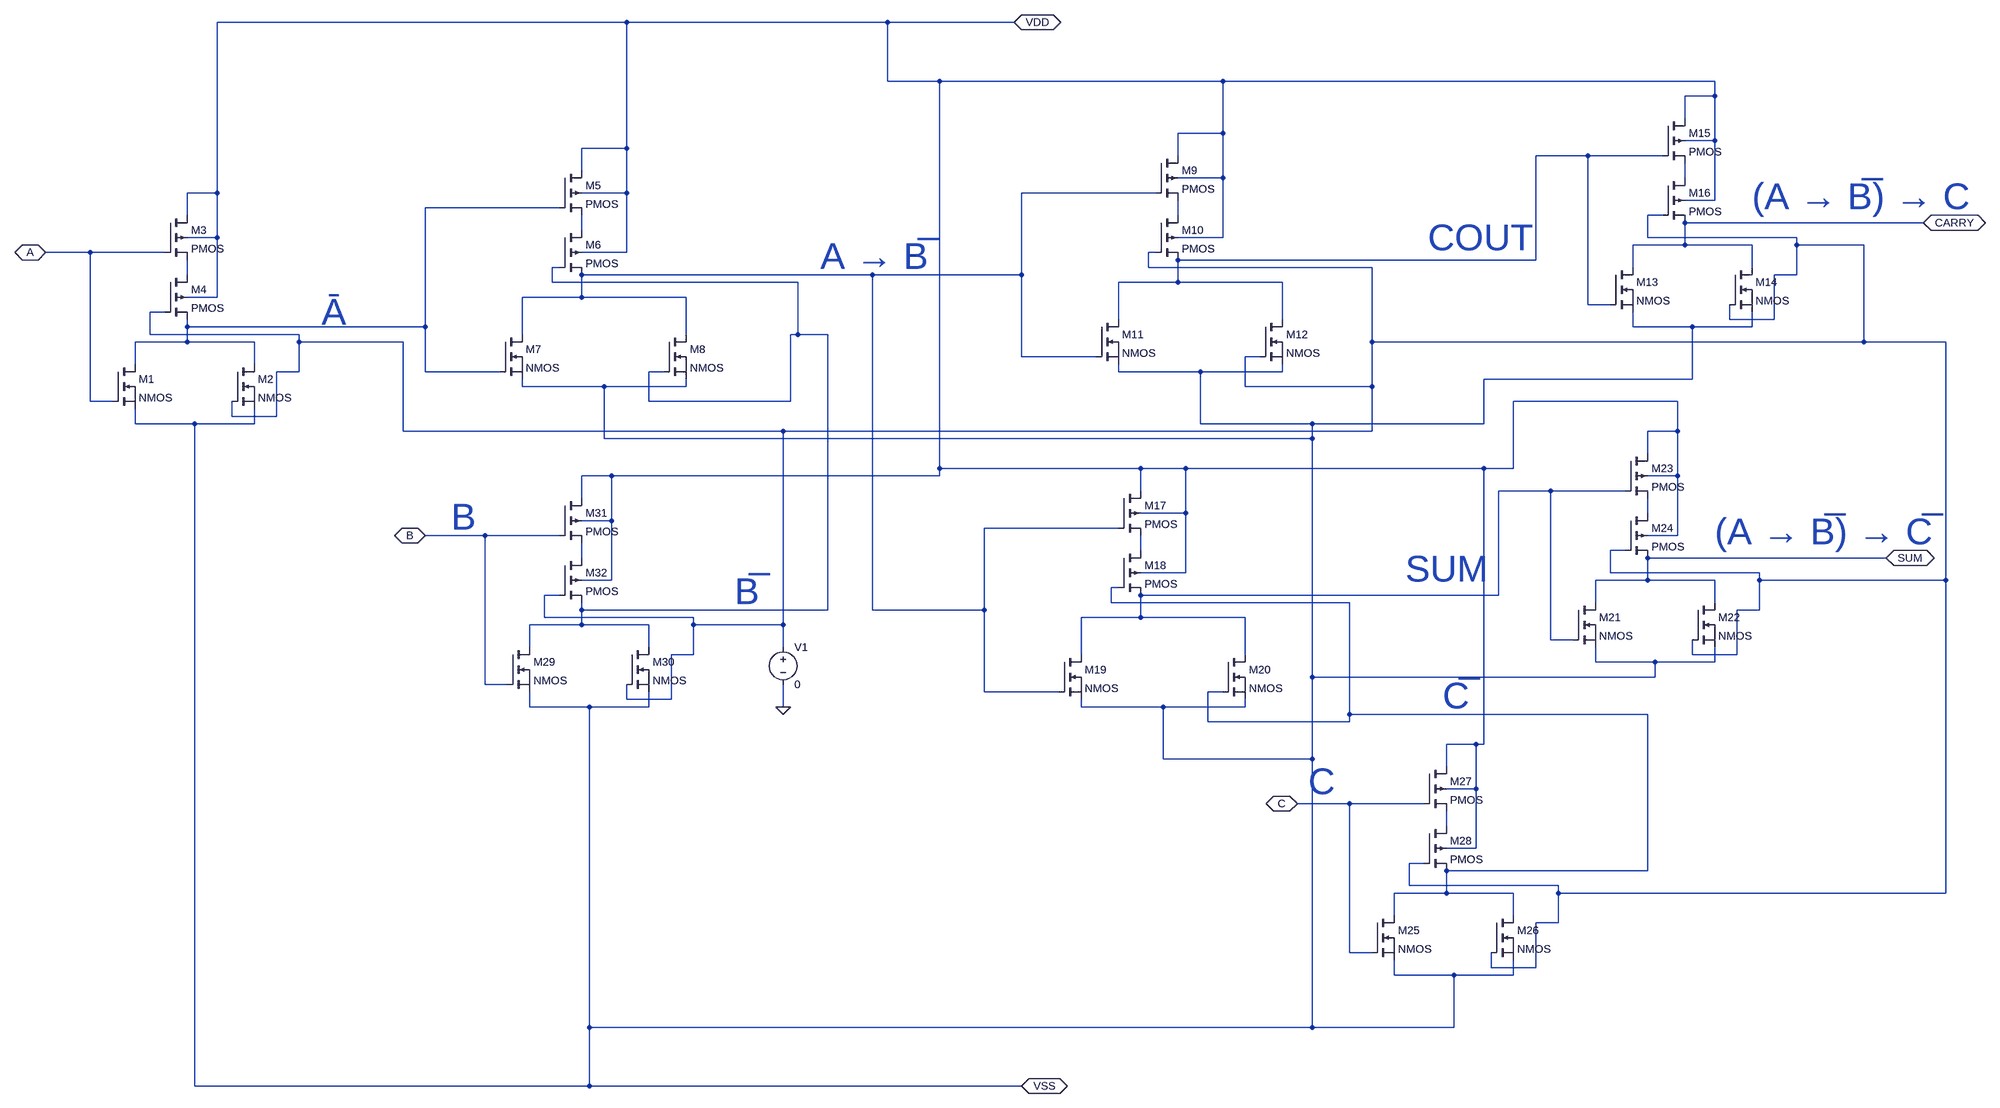
[diagram p0: schematic fulladderother.asc]
fulladderother.asc, the LTspice schematic file:
Version 4
SHEET 1 3388 1144
WIRE 464 -1824 -480 -1824
WIRE 1024 -1824 464 -1824
WIRE 1296 -1824 1024 -1824
WIRE 1024 -1616 1024 -1824
WIRE 1136 -1616 1024 -1616
WIRE 1744 -1616 1136 -1616
WIRE 2800 -1616 1744 -1616
WIRE 2800 -1584 2800 -1616
WIRE 2800 -1584 2736 -1584
WIRE 2736 -1536 2736 -1584
WIRE 1744 -1504 1744 -1616
WIRE 1744 -1504 1648 -1504
WIRE 2800 -1488 2800 -1584
WIRE 2800 -1488 2736 -1488
WIRE 464 -1472 464 -1824
WIRE 464 -1472 368 -1472
WIRE 1648 -1456 1648 -1504
WIRE 2528 -1456 2416 -1456
WIRE 2688 -1456 2528 -1456
WIRE 368 -1424 368 -1472
WIRE 1744 -1408 1744 -1504
WIRE 1744 -1408 1648 -1408
WIRE 2736 -1408 2736 -1440
WIRE -480 -1376 -480 -1824
WIRE -480 -1376 -544 -1376
WIRE 464 -1376 464 -1472
WIRE 464 -1376 368 -1376
WIRE 1600 -1376 1312 -1376
WIRE 2800 -1360 2800 -1488
WIRE 2800 -1360 2736 -1360
WIRE 320 -1344 32 -1344
WIRE -544 -1328 -544 -1376
WIRE 1648 -1328 1648 -1360
WIRE 2688 -1328 2656 -1328
WIRE 3248 -1312 2736 -1312
WIRE 368 -1296 368 -1328
WIRE -480 -1280 -480 -1376
WIRE -480 -1280 -544 -1280
WIRE 1744 -1280 1744 -1408
WIRE 1744 -1280 1648 -1280
WIRE 2656 -1280 2656 -1328
WIRE 2976 -1280 2656 -1280
WIRE 2736 -1264 2736 -1312
WIRE 2736 -1264 2624 -1264
WIRE 2880 -1264 2736 -1264
WIRE 2976 -1264 2976 -1280
WIRE 3120 -1264 2976 -1264
WIRE -752 -1248 -848 -1248
WIRE -592 -1248 -752 -1248
WIRE 464 -1248 464 -1376
WIRE 464 -1248 368 -1248
WIRE 1600 -1248 1584 -1248
WIRE 2416 -1232 2416 -1456
WIRE 2416 -1232 1648 -1232
WIRE 320 -1216 304 -1216
WIRE 1584 -1216 1584 -1248
WIRE 2064 -1216 1584 -1216
WIRE 2624 -1216 2624 -1264
WIRE 2880 -1216 2880 -1264
WIRE -544 -1200 -544 -1232
WIRE 992 -1200 368 -1200
WIRE 1312 -1200 1312 -1376
WIRE 1312 -1200 992 -1200
WIRE 2976 -1200 2976 -1264
WIRE 2976 -1200 2928 -1200
WIRE 304 -1184 304 -1216
WIRE 832 -1184 304 -1184
WIRE 1648 -1184 1648 -1232
WIRE 1648 -1184 1520 -1184
WIRE 1872 -1184 1648 -1184
WIRE -480 -1152 -480 -1280
WIRE -480 -1152 -544 -1152
WIRE 368 -1152 368 -1200
WIRE 368 -1152 240 -1152
WIRE 592 -1152 368 -1152
WIRE 2528 -1136 2528 -1456
WIRE 2576 -1136 2528 -1136
WIRE -592 -1120 -624 -1120
WIRE 1520 -1104 1520 -1184
WIRE 1872 -1104 1872 -1184
WIRE 2832 -1104 2832 -1136
WIRE 2928 -1104 2928 -1200
WIRE 2928 -1104 2832 -1104
WIRE -544 -1088 -544 -1104
WIRE 32 -1088 32 -1344
WIRE 32 -1088 -544 -1088
WIRE 2624 -1088 2624 -1120
WIRE 2752 -1088 2624 -1088
WIRE 2880 -1088 2880 -1120
WIRE 2880 -1088 2752 -1088
WIRE -624 -1072 -624 -1120
WIRE -304 -1072 -624 -1072
WIRE 240 -1072 240 -1152
WIRE 592 -1072 592 -1152
WIRE 832 -1072 832 -1184
WIRE 832 -1072 816 -1072
WIRE 896 -1072 832 -1072
WIRE -544 -1056 -544 -1088
WIRE -544 -1056 -656 -1056
WIRE -400 -1056 -544 -1056
WIRE -304 -1056 -304 -1072
WIRE -16 -1056 -304 -1056
WIRE 2064 -1056 2064 -1216
WIRE 3120 -1056 3120 -1264
WIRE 3120 -1056 2064 -1056
WIRE 3296 -1056 3120 -1056
WIRE 1312 -1024 1312 -1200
WIRE 1472 -1024 1312 -1024
WIRE 1824 -1024 1792 -1024
WIRE -656 -1008 -656 -1056
WIRE -400 -1008 -400 -1056
WIRE -304 -992 -304 -1056
WIRE -304 -992 -352 -992
WIRE 32 -992 32 -1088
WIRE 192 -992 32 -992
WIRE 544 -992 512 -992
WIRE 1520 -992 1520 -1008
WIRE 1696 -992 1520 -992
WIRE 1872 -992 1872 -1008
WIRE 1872 -992 1696 -992
WIRE 2752 -976 2752 -1088
WIRE 2752 -976 2304 -976
WIRE 240 -960 240 -976
WIRE 416 -960 240 -960
WIRE 592 -960 592 -976
WIRE 592 -960 416 -960
WIRE 1792 -960 1792 -1024
WIRE 2064 -960 2064 -1056
WIRE 2064 -960 1792 -960
WIRE -752 -928 -752 -1248
WIRE -704 -928 -752 -928
WIRE 512 -928 512 -992
WIRE 816 -928 816 -1072
WIRE 816 -928 512 -928
WIRE 2720 -928 2368 -928
WIRE -448 -896 -448 -928
WIRE -352 -896 -352 -992
WIRE -352 -896 -448 -896
WIRE -656 -880 -656 -912
WIRE -528 -880 -656 -880
WIRE -400 -880 -400 -912
WIRE -400 -880 -528 -880
WIRE 1696 -880 1696 -992
WIRE 1936 -880 1696 -880
WIRE 2304 -880 2304 -976
WIRE 2304 -880 1936 -880
WIRE -16 -864 -16 -1056
WIRE 800 -864 -16 -864
WIRE 2064 -864 2064 -960
WIRE 2064 -864 800 -864
WIRE 2720 -864 2720 -928
WIRE 2720 -864 2656 -864
WIRE 416 -848 416 -960
WIRE 1936 -848 1936 -880
WIRE 1936 -848 416 -848
WIRE 2656 -816 2656 -864
WIRE 1136 -784 1136 -1616
WIRE 1568 -784 1136 -784
WIRE 1664 -784 1568 -784
WIRE 2304 -784 1664 -784
WIRE 2368 -784 2368 -928
WIRE 2368 -784 2304 -784
WIRE 432 -768 368 -768
WIRE 1136 -768 1136 -784
WIRE 1136 -768 432 -768
WIRE 2720 -768 2720 -864
WIRE 2720 -768 2656 -768
WIRE 1568 -736 1568 -784
WIRE 2448 -736 2336 -736
WIRE 2608 -736 2448 -736
WIRE 368 -720 368 -768
WIRE 1664 -688 1664 -784
WIRE 1664 -688 1568 -688
WIRE 2656 -688 2656 -720
WIRE 432 -672 432 -768
WIRE 432 -672 368 -672
WIRE 1520 -656 1232 -656
WIRE 160 -640 32 -640
WIRE 320 -640 160 -640
WIRE 2720 -640 2720 -768
WIRE 2720 -640 2656 -640
WIRE 1568 -608 1568 -640
WIRE 2608 -608 2576 -608
WIRE 368 -592 368 -624
WIRE 3168 -592 2656 -592
WIRE 1664 -560 1664 -688
WIRE 1664 -560 1568 -560
WIRE 2576 -560 2576 -608
WIRE 2896 -560 2576 -560
WIRE 432 -544 432 -672
WIRE 432 -544 368 -544
WIRE 2656 -544 2656 -592
WIRE 2656 -544 2544 -544
WIRE 2800 -544 2656 -544
WIRE 2896 -544 2896 -560
WIRE 3296 -544 3296 -1056
WIRE 3296 -544 2896 -544
WIRE 1520 -528 1504 -528
WIRE 320 -512 288 -512
WIRE 2336 -512 2336 -736
WIRE 2336 -512 1568 -512
WIRE 1504 -496 1504 -528
WIRE 2016 -496 1504 -496
WIRE 2544 -496 2544 -544
WIRE 2800 -496 2800 -544
WIRE 368 -480 368 -496
WIRE 896 -480 896 -1072
WIRE 896 -480 368 -480
WIRE 992 -480 992 -1200
WIRE 1232 -480 1232 -656
WIRE 1232 -480 992 -480
WIRE 2896 -480 2896 -544
WIRE 2896 -480 2848 -480
WIRE 288 -464 288 -512
WIRE 608 -464 288 -464
WIRE 1568 -464 1568 -512
WIRE 1568 -464 1440 -464
WIRE 1792 -464 1568 -464
WIRE 368 -448 368 -480
WIRE 368 -448 256 -448
WIRE 512 -448 368 -448
WIRE 608 -448 608 -464
WIRE 800 -448 800 -864
WIRE 800 -448 608 -448
WIRE 2448 -416 2448 -736
WIRE 2496 -416 2448 -416
WIRE 256 -400 256 -448
WIRE 512 -400 512 -448
WIRE 800 -400 800 -448
WIRE 608 -384 608 -448
WIRE 608 -384 560 -384
WIRE 1440 -384 1440 -464
WIRE 1792 -384 1792 -464
WIRE 2752 -384 2752 -416
WIRE 2848 -384 2848 -480
WIRE 2848 -384 2752 -384
WIRE 2544 -368 2544 -400
WIRE 2672 -368 2544 -368
WIRE 2800 -368 2800 -400
WIRE 2800 -368 2672 -368
WIRE 1936 -336 1936 -848
WIRE 2672 -336 2672 -368
WIRE 2672 -336 1936 -336
WIRE 160 -320 160 -640
WIRE 208 -320 160 -320
WIRE 1232 -304 1232 -480
WIRE 1392 -304 1232 -304
WIRE 1744 -304 1712 -304
WIRE 464 -288 464 -320
WIRE 560 -288 560 -384
WIRE 560 -288 464 -288
WIRE 256 -272 256 -304
WIRE 384 -272 256 -272
WIRE 512 -272 512 -304
WIRE 512 -272 384 -272
WIRE 800 -272 800 -320
WIRE 1440 -272 1440 -288
WIRE 1616 -272 1440 -272
WIRE 1792 -272 1792 -288
WIRE 1792 -272 1616 -272
WIRE 2016 -256 2016 -496
WIRE 2656 -256 2016 -256
WIRE 1712 -240 1712 -304
WIRE 2016 -240 2016 -256
WIRE 2016 -240 1712 -240
WIRE 2288 -192 2224 -192
WIRE 2304 -192 2304 -784
WIRE 2304 -192 2288 -192
WIRE 1616 -160 1616 -272
WIRE 1936 -160 1936 -336
WIRE 1936 -160 1616 -160
WIRE 2224 -144 2224 -192
WIRE 2288 -96 2288 -192
WIRE 2288 -96 2224 -96
WIRE 2016 -64 1904 -64
WIRE 2176 -64 2016 -64
WIRE 2224 -16 2224 -48
WIRE 2288 32 2288 -96
WIRE 2288 32 2224 32
WIRE 2176 64 2144 64
WIRE 2656 80 2656 -256
WIRE 2656 80 2224 80
WIRE 2144 112 2144 64
WIRE 2464 112 2144 112
WIRE 2224 128 2224 80
WIRE 2224 128 2112 128
WIRE 2368 128 2224 128
WIRE 2464 128 2464 112
WIRE 3296 128 3296 -544
WIRE 3296 128 2464 128
WIRE 2112 176 2112 128
WIRE 2368 176 2368 128
WIRE 2464 192 2464 128
WIRE 2464 192 2416 192
WIRE 2016 256 2016 -64
WIRE 2064 256 2016 256
WIRE 2320 288 2320 256
WIRE 2416 288 2416 192
WIRE 2416 288 2320 288
WIRE 2112 304 2112 272
WIRE 2240 304 2112 304
WIRE 2368 304 2368 272
WIRE 2368 304 2240 304
WIRE 384 560 384 -272
WIRE 1936 560 1936 -160
WIRE 1936 560 384 560
WIRE 2240 560 2240 304
WIRE 2240 560 1936 560
WIRE -528 704 -528 -880
WIRE 384 704 384 560
WIRE 384 704 -528 704
WIRE 1312 704 384 704
FLAG 3248 -1312 CARRY
IOPIN 3248 -1312 BiDir
FLAG 3168 -592 SUM
IOPIN 3168 -592 BiDir
FLAG 800 -272 0
FLAG -848 -1248 A
IOPIN -848 -1248 BiDir
FLAG 1296 -1824 VDD
IOPIN 1296 -1824 BiDir
FLAG 32 -640 B
IOPIN 32 -640 BiDir
FLAG 1312 704 VSS
IOPIN 1312 704 BiDir
FLAG 1904 -64 C
IOPIN 1904 -64 BiDir
SYMBOL nmos -704 -1008 R0
SYMATTR InstName M1
SYMBOL nmos -448 -1008 R0
SYMATTR InstName M2
SYMBOL pmos4 -592 -1328 R0
SYMATTR InstName M3
SYMBOL pmos4 -592 -1200 R0
SYMATTR InstName M4
SYMBOL pmos4 320 -1424 R0
SYMATTR InstName M5
SYMBOL pmos4 320 -1296 R0
SYMATTR InstName M6
SYMBOL nmos 192 -1072 R0
SYMATTR InstName M7
SYMBOL nmos 544 -1072 R0
SYMATTR InstName M8
SYMBOL pmos4 1600 -1456 R0
SYMATTR InstName M9
SYMBOL pmos4 1600 -1328 R0
SYMATTR InstName M10
SYMBOL nmos 1472 -1104 R0
SYMATTR InstName M11
SYMBOL nmos 1824 -1104 R0
SYMATTR InstName M12
SYMBOL nmos 2576 -1216 R0
SYMATTR InstName M13
SYMBOL nmos 2832 -1216 R0
SYMATTR InstName M14
SYMBOL pmos4 2688 -1536 R0
SYMATTR InstName M15
SYMBOL pmos4 2688 -1408 R0
SYMATTR InstName M16
SYMBOL pmos4 1520 -736 R0
SYMATTR InstName M17
SYMBOL pmos4 1520 -608 R0
SYMATTR InstName M18
SYMBOL nmos 1392 -384 R0
SYMATTR InstName M19
SYMBOL nmos 1744 -384 R0
SYMATTR InstName M20
SYMBOL nmos 2496 -496 R0
SYMATTR InstName M21
SYMBOL nmos 2752 -496 R0
SYMATTR InstName M22
SYMBOL pmos4 2608 -816 R0
SYMATTR InstName M23
SYMBOL pmos4 2608 -688 R0
SYMATTR InstName M24
SYMBOL nmos 2064 176 R0
SYMATTR InstName M25
SYMBOL nmos 2320 176 R0
SYMATTR InstName M26
SYMBOL pmos4 2176 -144 R0
SYMATTR InstName M27
SYMBOL pmos4 2176 -16 R0
SYMATTR InstName M28
SYMBOL nmos 208 -400 R0
SYMATTR InstName M29
SYMBOL voltage 800 -416 R0
WINDOW 123 0 0 Left 0
WINDOW 39 0 0 Left 0
SYMATTR InstName V1
SYMATTR Value 0
SYMBOL nmos 464 -400 R0
SYMATTR InstName M30
SYMBOL pmos4 320 -720 R0
SYMATTR InstName M31
SYMBOL pmos4 320 -592 R0
SYMATTR InstName M32
TEXT -256 -1120 Left 6 ;Ā
TEXT 696 -520 Left 6 ;B̅
TEXT 88 -680 Left 6 ;B
TEXT 2216 -296 Left 6 ;C̅
TEXT 880 -1240 Left 6 ;A → B̅
TEXT 2880 -1368 Left 6 ;(A → B̅) → C
TEXT 2800 -648 Left 6 ;(A → B̅) → C̅
TEXT 2136 -568 Left 6 ;SUM
TEXT 2184 -1280 Left 6 ;COUT
TEXT 1928 -112 Left 6 ;C

The netlist it stands for:
* fulladderother.asc
M1 N004 A VSS VSS NMOS
M2 N004 N006 VSS VSS NMOS
M3 VDD A N009 VDD PMOS
M4 N009 N006 N004 VDD PMOS
M5 VDD N004 N007 VDD PMOS
M6 N007 N008 N003 VDD PMOS
M7 N003 N004 VSS VSS NMOS
M8 N003 N008 VSS VSS NMOS
M9 VDD N003 N005 VDD PMOS
M10 N005 N006 N001 VDD PMOS
M11 N001 N003 VSS VSS NMOS
M12 N001 N006 VSS VSS NMOS
M13 CARRY N001 VSS VSS NMOS
M14 CARRY N006 VSS VSS NMOS
M15 VDD N001 N002 VDD PMOS
M16 N002 N006 CARRY VDD PMOS
M17 VDD N003 N012 VDD PMOS
M18 N012 N014 N010 VDD PMOS
M19 N010 N003 VSS VSS NMOS
M20 N010 N014 VSS VSS NMOS
M21 SUM N010 VSS VSS NMOS
M22 SUM N006 VSS VSS NMOS
M23 VDD N010 N011 VDD PMOS
M24 N011 N006 SUM VDD PMOS
M25 N014 C VSS VSS NMOS
M26 N014 N006 VSS VSS NMOS
M27 VDD C N015 VDD PMOS
M28 N015 N006 N014 VDD PMOS
M29 N008 B VSS VSS NMOS
V1 N006 0 0
M30 N008 N006 VSS VSS NMOS
M31 VDD B N013 VDD PMOS
M32 N013 N006 N008 VDD PMOS
.model NMOS NMOS
.model PMOS PMOS
.lib standard.mos
* Ā
* B̅
* B
* C̅
* A → B̅
* (A → B̅) → C
* (A → B̅) → C̅
* SUM
* COUT
* C
.backanno
.end